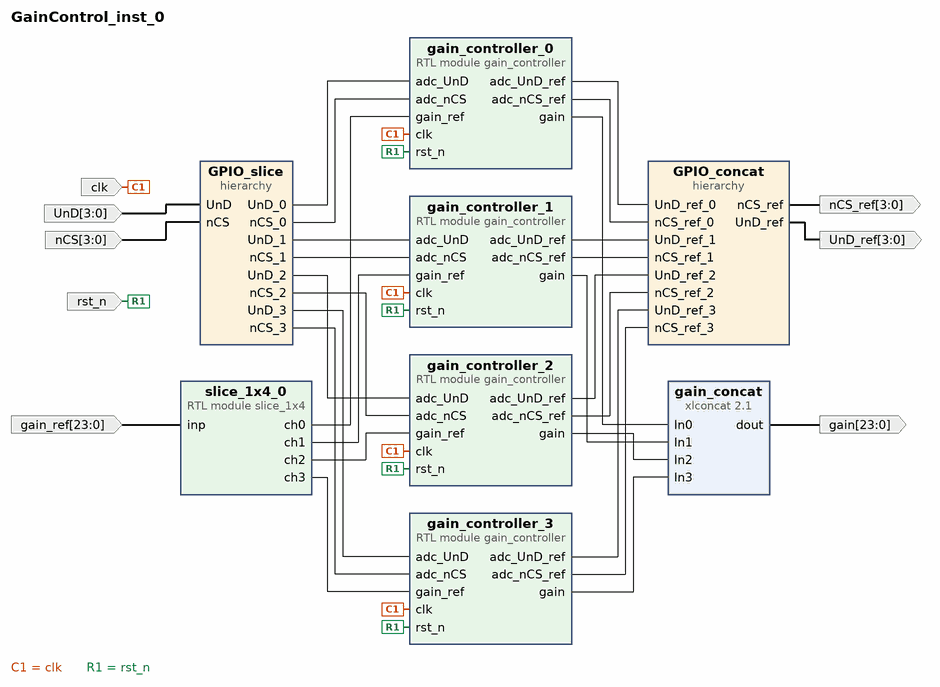
[diagram p0: block diagram of the top level]
# Vivado block design GainControl_inst_0, xczu3eg-sbva484-1-i, Vivado 2020.2
create_bd_design GainControl_inst_0

create_bd_port -dir I -from 3 -to 0 UnD
create_bd_port -dir O -from 3 -to 0 UnD_ref
create_bd_port -dir I -type clk clk
create_bd_port -dir I -from 23 -to 0 gain_ref
create_bd_port -dir I -from 3 -to 0 nCS
create_bd_port -dir O -from 3 -to 0 nCS_ref
create_bd_port -dir I -type rst rst_n
create_bd_port -dir O -from 23 -to 0 gain

create_bd_cell -type hier GPIO_concat
create_bd_cell -type hier GPIO_slice
create_bd_cell -type ip -vlnv xilinx.com:ip:xlconcat:2.1 gain_concat
set_property -dict [list \
  CONFIG.IN0_WIDTH 6 \
  CONFIG.IN1_WIDTH 6 \
  CONFIG.IN2_WIDTH 6 \
  CONFIG.IN3_WIDTH 6 \
  CONFIG.NUM_PORTS 4 \
] [get_bd_cells gain_concat]
create_bd_cell -type module -reference gain_controller gain_controller_0
create_bd_cell -type module -reference gain_controller gain_controller_1
create_bd_cell -type module -reference gain_controller gain_controller_2
create_bd_cell -type module -reference gain_controller gain_controller_3
create_bd_cell -type module -reference slice_1x4 slice_1x4_0

# ---- hierarchy /GPIO_concat ----
current_bd_instance /GPIO_concat
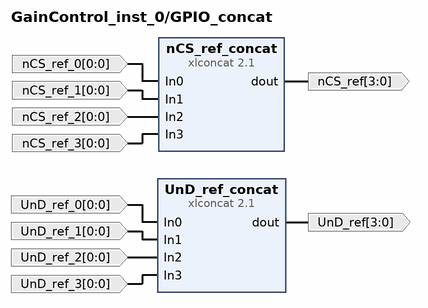
[diagram p1: block diagram inside /GPIO_concat]
create_bd_pin -dir I -from 0 -to 0 UnD_ref_0
create_bd_pin -dir I -from 0 -to 0 UnD_ref_1
create_bd_pin -dir I -from 0 -to 0 UnD_ref_2
create_bd_pin -dir I -from 0 -to 0 UnD_ref_3
create_bd_pin -dir O -from 3 -to 0 UnD_ref
create_bd_pin -dir I -from 0 -to 0 nCS_ref_0
create_bd_pin -dir I -from 0 -to 0 nCS_ref_1
create_bd_pin -dir I -from 0 -to 0 nCS_ref_2
create_bd_pin -dir I -from 0 -to 0 nCS_ref_3
create_bd_pin -dir O -from 3 -to 0 nCS_ref

create_bd_cell -type ip -vlnv xilinx.com:ip:xlconcat:2.1 UnD_ref_concat
set_property -dict {CONFIG.NUM_PORTS 4} [get_bd_cells UnD_ref_concat]
create_bd_cell -type ip -vlnv xilinx.com:ip:xlconcat:2.1 nCS_ref_concat
set_property -dict {CONFIG.NUM_PORTS 4} [get_bd_cells nCS_ref_concat]

# ---- hierarchy /GPIO_slice ----
current_bd_instance /GPIO_slice
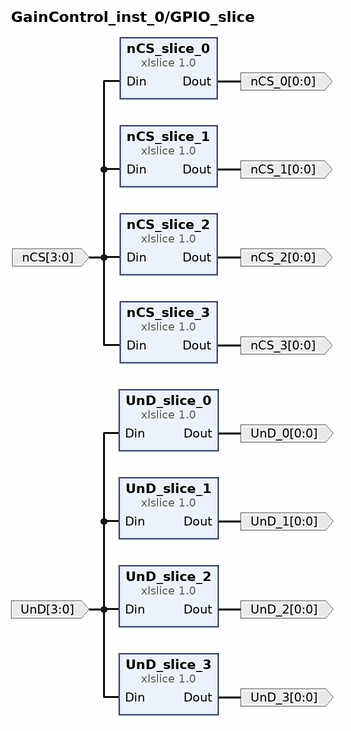
[diagram p2: block diagram inside /GPIO_slice]
create_bd_pin -dir I -from 3 -to 0 UnD
create_bd_pin -dir O -from 0 -to 0 UnD_1
create_bd_pin -dir O -from 0 -to 0 UnD_2
create_bd_pin -dir O -from 0 -to 0 UnD_3
create_bd_pin -dir I -from 3 -to 0 nCS
create_bd_pin -dir O -from 0 -to 0 nCS_1
create_bd_pin -dir O -from 0 -to 0 nCS_2
create_bd_pin -dir O -from 0 -to 0 nCS_3
create_bd_pin -dir O -from 0 -to 0 UnD_0
create_bd_pin -dir O -from 0 -to 0 nCS_0

create_bd_cell -type ip -vlnv xilinx.com:ip:xlslice:1.0 UnD_slice_1
set_property -dict {CONFIG.DIN_FROM 1 CONFIG.DIN_TO 1 CONFIG.DIN_WIDTH 4 CONFIG.DOUT_WIDTH 1} [get_bd_cells UnD_slice_1]
create_bd_cell -type ip -vlnv xilinx.com:ip:xlslice:1.0 UnD_slice_2
set_property -dict {CONFIG.DIN_FROM 2 CONFIG.DIN_TO 2 CONFIG.DIN_WIDTH 4 CONFIG.DOUT_WIDTH 1} [get_bd_cells UnD_slice_2]
create_bd_cell -type ip -vlnv xilinx.com:ip:xlslice:1.0 UnD_slice_3
set_property -dict {CONFIG.DIN_FROM 3 CONFIG.DIN_TO 3 CONFIG.DIN_WIDTH 4 CONFIG.DOUT_WIDTH 1} [get_bd_cells UnD_slice_3]
create_bd_cell -type ip -vlnv xilinx.com:ip:xlslice:1.0 nCS_slice_1
set_property -dict {CONFIG.DIN_FROM 1 CONFIG.DIN_TO 1 CONFIG.DIN_WIDTH 4 CONFIG.DOUT_WIDTH 1} [get_bd_cells nCS_slice_1]
create_bd_cell -type ip -vlnv xilinx.com:ip:xlslice:1.0 nCS_slice_2
set_property -dict {CONFIG.DIN_FROM 2 CONFIG.DIN_TO 2 CONFIG.DIN_WIDTH 4 CONFIG.DOUT_WIDTH 1} [get_bd_cells nCS_slice_2]
create_bd_cell -type ip -vlnv xilinx.com:ip:xlslice:1.0 nCS_slice_3
set_property -dict {CONFIG.DIN_FROM 3 CONFIG.DIN_TO 3 CONFIG.DIN_WIDTH 4 CONFIG.DOUT_WIDTH 1} [get_bd_cells nCS_slice_3]
create_bd_cell -type ip -vlnv xilinx.com:ip:xlslice:1.0 UnD_slice_0
set_property -dict {CONFIG.DIN_WIDTH 4} [get_bd_cells UnD_slice_0]
create_bd_cell -type ip -vlnv xilinx.com:ip:xlslice:1.0 nCS_slice_0
set_property -dict {CONFIG.DIN_WIDTH 4} [get_bd_cells nCS_slice_0]

# ---- connections ----

current_bd_instance /GPIO_concat
connect_bd_net -net gain_controller_0_adc_UnD_ref [get_bd_pins UnD_ref_0] [get_bd_pins UnD_ref_concat/In0]
connect_bd_net -net gain_controller_1_adc_UnD_ref [get_bd_pins UnD_ref_1] [get_bd_pins UnD_ref_concat/In1]
connect_bd_net -net gain_controller_2_adc_UnD_ref [get_bd_pins UnD_ref_2] [get_bd_pins UnD_ref_concat/In2]
connect_bd_net -net gain_controller_3_adc_UnD_ref [get_bd_pins UnD_ref_3] [get_bd_pins UnD_ref_concat/In3]
connect_bd_net [get_bd_pins UnD_ref_concat/dout] [get_bd_pins UnD_ref]
connect_bd_net -net gain_controller_0_adc_nCS_ref [get_bd_pins nCS_ref_0] [get_bd_pins nCS_ref_concat/In0]
connect_bd_net -net gain_controller_1_adc_nCS_ref [get_bd_pins nCS_ref_1] [get_bd_pins nCS_ref_concat/In1]
connect_bd_net -net gain_controller_2_adc_nCS_ref [get_bd_pins nCS_ref_2] [get_bd_pins nCS_ref_concat/In2]
connect_bd_net -net gain_controller_3_adc_nCS_ref [get_bd_pins nCS_ref_3] [get_bd_pins nCS_ref_concat/In3]
connect_bd_net [get_bd_pins nCS_ref_concat/dout] [get_bd_pins nCS_ref]

current_bd_instance /GPIO_slice
connect_bd_net -net Din_1 [get_bd_pins UnD] \
  [get_bd_pins UnD_slice_3/Din] [get_bd_pins UnD_slice_2/Din] [get_bd_pins UnD_slice_0/Din] [get_bd_pins UnD_slice_1/Din]
connect_bd_net [get_bd_pins UnD_slice_1/Dout] [get_bd_pins UnD_1]
connect_bd_net [get_bd_pins UnD_slice_2/Dout] [get_bd_pins UnD_2]
connect_bd_net [get_bd_pins UnD_slice_3/Dout] [get_bd_pins UnD_3]
connect_bd_net [get_bd_pins nCS] \
  [get_bd_pins nCS_slice_0/Din] [get_bd_pins nCS_slice_3/Din] [get_bd_pins nCS_slice_2/Din] [get_bd_pins nCS_slice_1/Din]
connect_bd_net [get_bd_pins nCS_slice_1/Dout] [get_bd_pins nCS_1]
connect_bd_net [get_bd_pins nCS_slice_2/Dout] [get_bd_pins nCS_2]
connect_bd_net [get_bd_pins nCS_slice_3/Dout] [get_bd_pins nCS_3]
connect_bd_net [get_bd_pins UnD_slice_0/Dout] [get_bd_pins UnD_0]
connect_bd_net [get_bd_pins nCS_slice_0/Dout] [get_bd_pins nCS_0]

current_bd_instance /
connect_bd_net -net Din_1 [get_bd_ports UnD] [get_bd_pins GPIO_slice/UnD]
connect_bd_net [get_bd_ports nCS] [get_bd_pins GPIO_slice/nCS]
connect_bd_net -net UnD_ref_concat_dout [get_bd_pins GPIO_concat/UnD_ref] [get_bd_ports UnD_ref]
connect_bd_net -net UnD_slice_0_Dout [get_bd_pins GPIO_slice/UnD_0] [get_bd_pins gain_controller_0/adc_UnD]
connect_bd_net -net UnD_slice_1_Dout [get_bd_pins GPIO_slice/UnD_1] [get_bd_pins gain_controller_1/adc_UnD]
connect_bd_net -net UnD_slice_2_Dout [get_bd_pins GPIO_slice/UnD_2] [get_bd_pins gain_controller_2/adc_UnD]
connect_bd_net -net UnD_slice_3_Dout [get_bd_pins GPIO_slice/UnD_3] [get_bd_pins gain_controller_3/adc_UnD]
connect_bd_net -net clk_0_1 [get_bd_ports clk] \
  [get_bd_pins gain_controller_0/clk] [get_bd_pins gain_controller_1/clk] [get_bd_pins gain_controller_2/clk] \
  [get_bd_pins gain_controller_3/clk]
connect_bd_net [get_bd_pins gain_concat/dout] [get_bd_ports gain]
connect_bd_net [get_bd_pins gain_controller_0/adc_UnD_ref] [get_bd_pins GPIO_concat/UnD_ref_0]
connect_bd_net [get_bd_pins gain_controller_0/adc_nCS_ref] [get_bd_pins GPIO_concat/nCS_ref_0]
connect_bd_net [get_bd_pins gain_controller_0/gain] [get_bd_pins gain_concat/In0]
connect_bd_net [get_bd_pins gain_controller_1/adc_UnD_ref] [get_bd_pins GPIO_concat/UnD_ref_1]
connect_bd_net [get_bd_pins gain_controller_1/adc_nCS_ref] [get_bd_pins GPIO_concat/nCS_ref_1]
connect_bd_net [get_bd_pins gain_controller_1/gain] [get_bd_pins gain_concat/In1]
connect_bd_net [get_bd_pins gain_controller_2/adc_UnD_ref] [get_bd_pins GPIO_concat/UnD_ref_2]
connect_bd_net [get_bd_pins gain_controller_2/adc_nCS_ref] [get_bd_pins GPIO_concat/nCS_ref_2]
connect_bd_net [get_bd_pins gain_controller_2/gain] [get_bd_pins gain_concat/In2]
connect_bd_net [get_bd_pins gain_controller_3/adc_UnD_ref] [get_bd_pins GPIO_concat/UnD_ref_3]
connect_bd_net [get_bd_pins gain_controller_3/adc_nCS_ref] [get_bd_pins GPIO_concat/nCS_ref_3]
connect_bd_net [get_bd_pins gain_controller_3/gain] [get_bd_pins gain_concat/In3]
connect_bd_net -net inp_1 [get_bd_ports gain_ref] [get_bd_pins slice_1x4_0/inp]
connect_bd_net -net nCS_ref_concat_dout [get_bd_pins GPIO_concat/nCS_ref] [get_bd_ports nCS_ref]
connect_bd_net -net nCS_slice_0_Dout [get_bd_pins GPIO_slice/nCS_0] [get_bd_pins gain_controller_0/adc_nCS]
connect_bd_net -net nCS_slice_1_Dout [get_bd_pins GPIO_slice/nCS_1] [get_bd_pins gain_controller_1/adc_nCS]
connect_bd_net -net nCS_slice_2_Dout [get_bd_pins GPIO_slice/nCS_2] [get_bd_pins gain_controller_2/adc_nCS]
connect_bd_net -net nCS_slice_3_Dout [get_bd_pins GPIO_slice/nCS_3] [get_bd_pins gain_controller_3/adc_nCS]
connect_bd_net -net rst_n_0_1 [get_bd_ports rst_n] \
  [get_bd_pins gain_controller_0/rst_n] [get_bd_pins gain_controller_1/rst_n] [get_bd_pins gain_controller_2/rst_n] \
  [get_bd_pins gain_controller_3/rst_n]
connect_bd_net [get_bd_pins slice_1x4_0/ch0] [get_bd_pins gain_controller_0/gain_ref]
connect_bd_net [get_bd_pins slice_1x4_0/ch1] [get_bd_pins gain_controller_1/gain_ref]
connect_bd_net [get_bd_pins slice_1x4_0/ch2] [get_bd_pins gain_controller_2/gain_ref]
connect_bd_net [get_bd_pins slice_1x4_0/ch3] [get_bd_pins gain_controller_3/gain_ref]

validate_bd_design
save_bd_design
